# Altium schematic sheet IMU.SchDoc
size A4
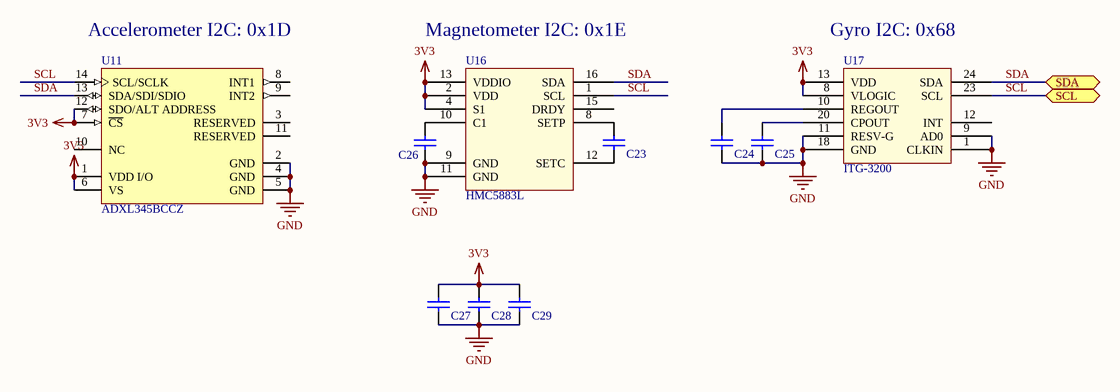
[diagram p0: IMU.SchDoc]

## Parts
C23  CAP 220nF 25V 0402(1005)  [CAPC0402(1005)60_N]  (value not drawn)
C24  CAP 100nF 25V 0402(1005)  [CAPC0402(1005)60_N]  (value not drawn)
C25  CAP 2.2nF 25V 0402(1005)  [CAPC0402(1005)60_N]  (value not drawn)
C26  CAP 4.7uF 6.3V 0402(1005)  [CAPC0402(1005)60_N]  (value not drawn)
C27  CAP 100nF 25V 0402(1005)  [CAPC0402(1005)60_N]  (value not drawn)
C28  CAP 100nF 25V 0402(1005)  [CAPC0402(1005)60_N]  (value not drawn)
C29  CAP 100nF 25V 0402(1005)  [CAPC0402(1005)60_N]  (value not drawn)
U11  ADXL345BCCZ  [ADI-CC-14-1_V]
U16  HMC5883L  [HMC5883L]
U17  ITG-3200  [ITG-3200]

## Ports
SCL (bidir), SDA (bidir)

## Nets
3V3: C27.2 C28.2 C29.2 U11.1(VDD_I/O) U11.6(VS) U11.7(~{CS}) U11.12(SDO/ALT_ADDRESS) U16.2(VDD) U16.4(S1) U16.13(VDDIO) U17.8(VLOGIC) U17.13(VDD)
GND: C24.1 C25.1 C26.1 C27.1 C28.1 C29.1 U11.2(GND) U11.4(GND) U11.5(GND) U16.9(GND) U16.11(GND) U17.1(CLKIN) U17.9(AD0) U17.11(RESV-G) U17.18(GND)
SCL: U11.14(SCL/SCLK) U16.1(SCL) U17.23(SCL) ; port SCL
SDA: U11.13(SDA/SDI/SDIO) U16.16(SDA) U17.24(SDA) ; port SDA
NetC23_1: C23.1 U16.12(SETC)
NetC23_2: C23.2 U16.8(SETP)
NetC24_2: C24.2 U17.10(REGOUT)
NetC25_2: C25.2 U17.20(CPOUT)
NetC26_2: C26.2 U16.10(C1)

Not connected (* = marked no-connect by the designer): U11 3(RESERVED) 8(INT1) 9(INT2) 10(NC) 11(RESERVED); U16 15(DRDY); U17 12(INT)

## Notes on the sheet
- (near U11) Accelerometer I2C: 0x1D
- (near U16) Magnetometer I2C: 0x1E
- (near U17) Gyro I2C: 0x68

## Library data of the parts
C23 = CMP-1034-02093-1: CAP 220nF 25V ±20% 0402 (1005 Metric) Thickness 0.6mm SMD; Case-EIA: 0402; Case-Metric: 1005; Rated Voltage: 25 V; Tolerance: ±20%; Value: 220nF; Technology: SMT; Max Thickness: 0.6 mm
C24 C27-C29 = CMP-1034-02073-1: CAP 100nF 25V ±20% 0402 (1005 Metric) Thickness 0.6mm SMD; Case-EIA: 0402; Case-Metric: 1005; Rated Voltage: 25 V; Value: 100nF; Tolerance: ±20%; Max Thickness: 0.6 mm; Technology: SMT
C25 = CMP-1034-01740-1: CAP 2.2nF 25V ±20% 0402 (1005 Metric) Thickness 0.6mm SMD; Case-EIA: 0402; Case-Metric: 1005; Technology: SMT; Max Thickness: 0.6 mm; Rated Voltage: 25 V; Tolerance: ±20%; Value: 2.2nF
C26 = CMP-1034-02137-1: CAP 4.7uF 6.3V ±20% 0402 (1005 Metric) Thickness 0.6mm SMD; Case-Metric: 1005; Case-EIA: 0402; Technology: SMT; Max Thickness: 0.6 mm; Tolerance: ±20%; Rated Voltage: 6.3 V; Value: 4.7uF
U11 = CMP-0885-00027-1: 3-Axis, +/-2 g / +/-4 g / +/-8 g / +/-16 g Digital Accelerometer with Digital Output, 1.6 KHz BW, Industrial, 14-pin LGA, Tray; Manufacturer: Analog Devices; Sensitivity: 256/128/64/32 LSB/g; Voltage Supply (V): 2.0 to 3.6; Supply Current: 140 uA; # of Axes: 3; -3dB Bandwidth: 1.6 KHz; PackageReference: CC-14-1; ComponentLink1Description: Manufacturer URL; Packing: Tray; ComponentLink4URL: http://www.analog.com/en/mems-sensors/mems-inertial-sensors/adxl345/products/product.html; ComponentLink2URL: http://www.analog.com/static/imported-files/data_sheets/ADXL345.pdf; Mounting Technology: Surface Mount; ComponentLink3URL: http://www.analog.com/static/imported-files/data_sheets/ADXL343.pdf; PartNumber: ADXL345BCCZ; ComponentLink4Description: Product URL; Output Type: Digital; ComponentLink3Description: Package Specification; DatasheetVersion: Rev. D; PackageVersion: 03-16-2010-A, 03/2010; ComponentLink1URL: http://www.analog.com/en/index.html; ComponentLink2Description: Datasheet; PackageDescription: 14-Pin Land Grid Array, 3 x 5 mm Body, 0.8 mm Pitch
U16 = HMC5883L: Supplier 1: Digi-Key; Supplier Part Number 1: 342-1082-1-ND
U17 = ITG-3200: RefDes: RefDes; Type: DEV; Value: Value; Supplier 1: Newark; Supplier Part Number 1: 37T8091